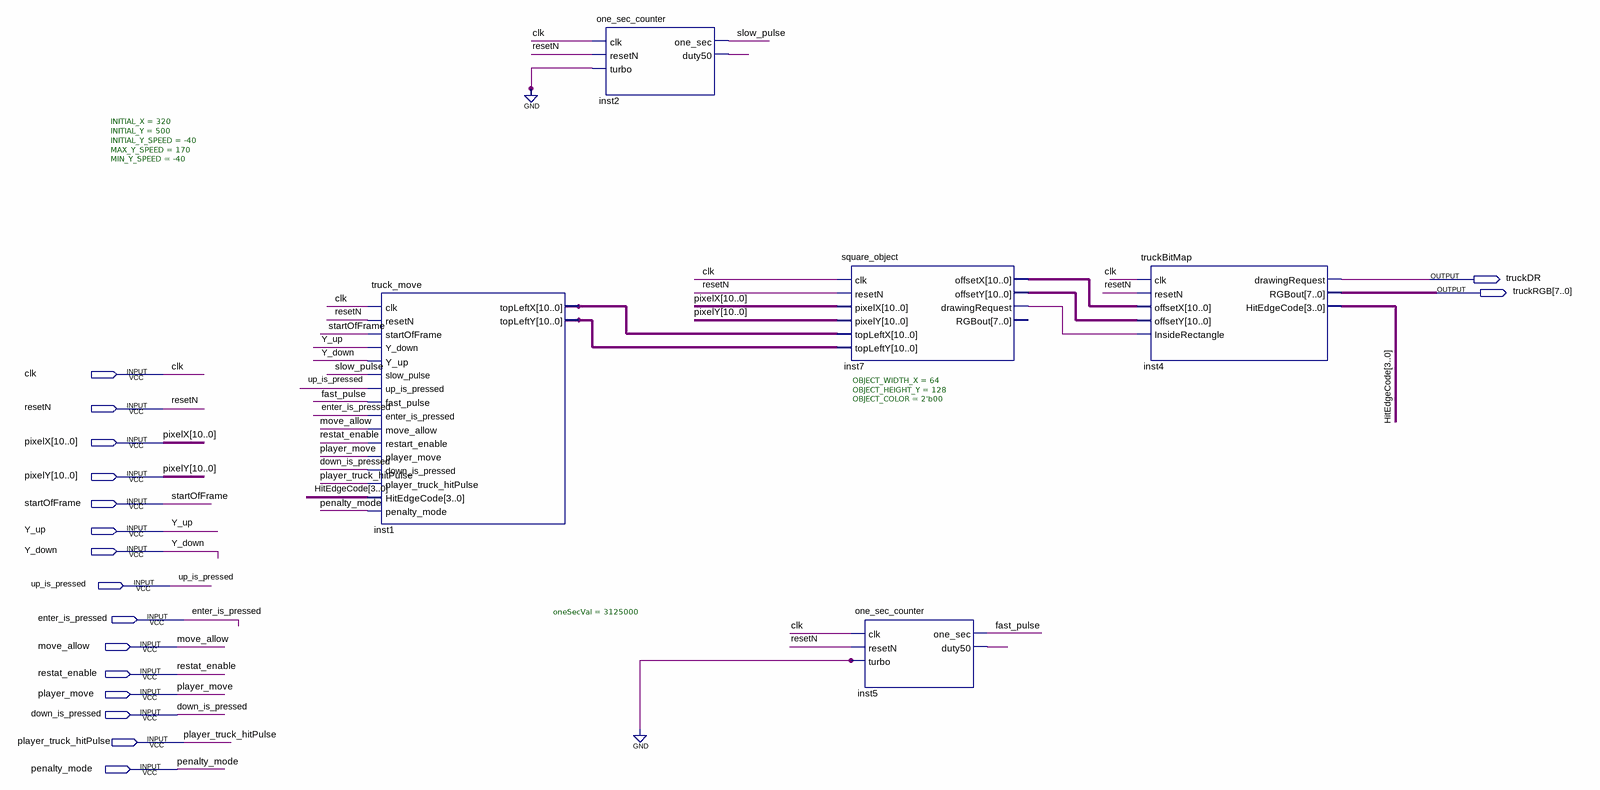
[diagram p0: schematic sheet]
// Quartus schematic truck_block.bdf as structural Verilog: 5 symbols, 17 pins
module truck_block (
  input  clk,
  input  resetN,
  input  [10:0] pixelX,
  input  [10:0] pixelY,
  input  startOfFrame,
  input  Y_up,
  input  Y_down,
  input  up_is_pressed,
  input  enter_is_pressed,
  input  move_allow,
  input  restat_enable,
  input  player_move,
  input  down_is_pressed,
  input  player_truck_hitPulse,
  input  penalty_mode,
  output truckDR,
  output [7:0] truckRGB
);

  wire fast_pulse, inst2_duty50, inst5_duty50, inst7_drawingrequest, slow_pulse;
  wire [3:0] HitEdgeCode;
  wire [10:0] inst1_topleftx, inst1_toplefty, inst7_offsetx, inst7_offsety;

  truck_move #(.INITIAL_X(320), .INITIAL_Y(500), .INITIAL_Y_SPEED(-40), .MAX_Y_SPEED(170), .MIN_Y_SPEED(-40)) inst1 (
    .clk(clk), .resetN(resetN), .startOfFrame(startOfFrame), .Y_down(Y_up), .Y_up(Y_down),
    .slow_pulse(slow_pulse), .up_is_pressed(up_is_pressed), .fast_pulse(fast_pulse),
    .enter_is_pressed(enter_is_pressed), .move_allow(move_allow), .restart_enable(restat_enable),
    .player_move(player_move), .down_is_pressed(down_is_pressed),
    .player_truck_hitPulse(player_truck_hitPulse), .HitEdgeCode(HitEdgeCode), .penalty_mode(penalty_mode),
    .topLeftX(inst1_topleftx), .topLeftY(inst1_toplefty));
  one_sec_counter inst2 (.clk(clk), .resetN(resetN), .turbo(1'b0), .one_sec(slow_pulse), .duty50(inst2_duty50));
  square_object #(.OBJECT_WIDTH_X(64), .OBJECT_HEIGHT_Y(128), .OBJECT_COLOR(2'b00)) inst7 (
    .clk(clk), .resetN(resetN), .pixelX(pixelX), .pixelY(pixelY), .topLeftX(inst1_topleftx),
    .topLeftY(inst1_toplefty), .offsetX(inst7_offsetx), .offsetY(inst7_offsety),
    .drawingRequest(inst7_drawingrequest));  // open: RGBout
  one_sec_counter #(.oneSecVal(3125000)) inst5 (
    .clk(clk), .resetN(resetN), .turbo(1'b0), .one_sec(fast_pulse), .duty50(inst5_duty50));
  truckBitMap inst4 (
    .clk(clk), .resetN(resetN), .offsetX(inst7_offsetx), .offsetY(inst7_offsety),
    .InsideRectangle(inst7_drawingrequest), .drawingRequest(truckDR), .RGBout(truckRGB),
    .HitEdgeCode(HitEdgeCode));
endmodule
